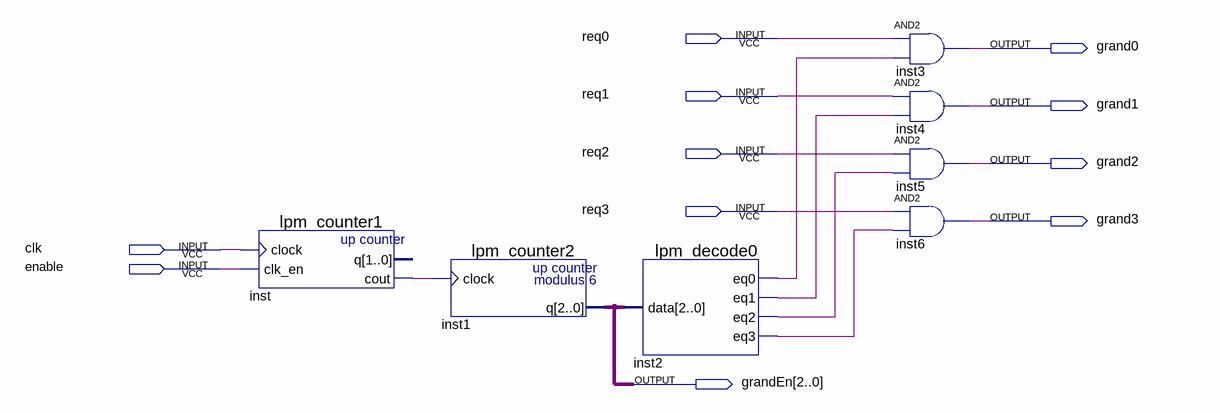
[diagram p0: schematic sheet]
// Quartus schematic Arbitr.bdf as structural Verilog: 7 symbols, 11 pins
module Arbitr (
  input  req0,
  input  req1,
  input  req2,
  input  req3,
  input  clk,
  input  enable,
  output grand0,
  output grand1,
  output grand2,
  output grand3,
  output [2:0] grandEn
);

  wire inst2_eq0, inst2_eq1, inst2_eq2, inst2_eq3, inst_cout;

  lpm_counter1 inst (.clock(clk), .clk_en(enable), .cout(inst_cout));  // open: q
  lpm_counter2 inst1 (.clock(inst_cout), .q(grandEn));
  lpm_decode0 inst2 (.data(grandEn), .eq0(inst2_eq0), .eq1(inst2_eq1), .eq2(inst2_eq2), .eq3(inst2_eq3));
  and inst3 (grand0, req0, inst2_eq0);
  and inst4 (grand1, req1, inst2_eq1);
  and inst5 (grand2, req2, inst2_eq2);
  and inst6 (grand3, req3, inst2_eq3);
endmodule
